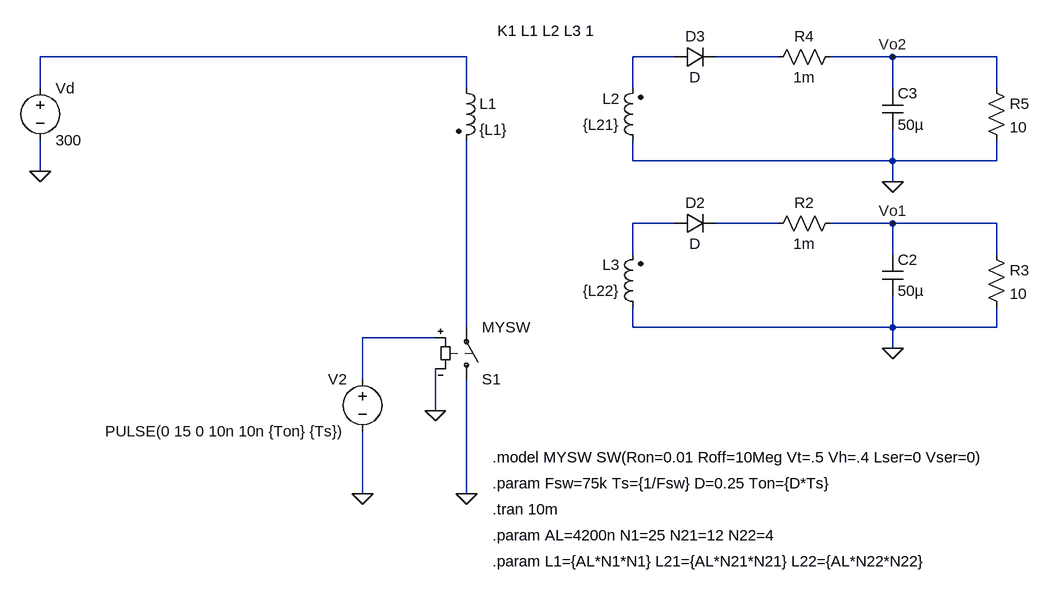
[diagram p0: schematic sch.asc]
sch.asc, the LTspice schematic file:
Version 4
SHEET 1 1032 856
WIRE -192 -336 -848 -336
WIRE 128 -336 64 -336
WIRE 288 -336 192 -336
WIRE 464 -336 368 -336
WIRE 624 -336 464 -336
WIRE -848 -288 -848 -336
WIRE -192 -288 -192 -336
WIRE 64 -288 64 -336
WIRE 464 -288 464 -336
WIRE 624 -288 624 -336
WIRE 64 -176 64 -208
WIRE 464 -176 464 -224
WIRE 464 -176 64 -176
WIRE 624 -176 624 -208
WIRE 624 -176 464 -176
WIRE -848 -160 -848 -208
WIRE 464 -144 464 -176
WIRE 128 -80 64 -80
WIRE 288 -80 192 -80
WIRE 464 -80 368 -80
WIRE 624 -80 464 -80
WIRE 64 -32 64 -80
WIRE 464 -32 464 -80
WIRE 624 -32 624 -80
WIRE -192 80 -192 -208
WIRE 64 80 64 48
WIRE 464 80 464 32
WIRE 464 80 64 80
WIRE 624 80 624 48
WIRE 624 80 464 80
WIRE -240 96 -352 96
WIRE 464 112 464 80
WIRE -352 160 -352 96
WIRE -240 208 -240 144
WIRE -352 336 -352 240
WIRE -192 336 -192 160
FLAG -192 336 0
FLAG -352 336 0
FLAG -848 -160 0
FLAG 464 -80 Vo1
FLAG -240 208 0
FLAG 464 -336 Vo2
FLAG 464 -144 0
FLAG 464 112 0
SYMBOL voltage -848 -304 R0
WINDOW 123 0 0 Left 0
WINDOW 39 0 0 Left 0
SYMATTR InstName Vd
SYMATTR Value 300
SYMBOL voltage -352 144 M0
WINDOW 123 0 0 Left 0
WINDOW 39 0 0 Left 0
SYMATTR InstName V2
SYMATTR Value PULSE(0 15 0 10n 10n {Ton} {Ts})
SYMBOL ind2 -208 -304 R0
SYMATTR InstName L1
SYMATTR Value {L1}
SYMATTR Type ind
SYMBOL ind2 80 64 R180
WINDOW 0 36 80 Left 2
WINDOW 3 36 40 Left 2
SYMATTR InstName L3
SYMATTR Value {L22}
SYMATTR Type ind
SYMBOL sw -192 176 M180
SYMATTR InstName S1
SYMATTR Value MYSW
SYMBOL diode 128 -64 R270
WINDOW 0 32 32 VTop 2
WINDOW 3 0 32 VBottom 2
SYMATTR InstName D2
SYMBOL res 384 -96 R90
WINDOW 0 0 56 VBottom 2
WINDOW 3 32 56 VTop 2
SYMATTR InstName R2
SYMATTR Value 1m
SYMBOL cap 448 -32 R0
SYMATTR InstName C2
SYMATTR Value 50µ
SYMBOL res 608 -48 R0
SYMATTR InstName R3
SYMATTR Value 10
SYMBOL ind2 80 -192 R180
WINDOW 0 36 80 Left 2
WINDOW 3 36 40 Left 2
SYMATTR InstName L2
SYMATTR Value {L21}
SYMATTR Type ind
SYMBOL diode 128 -320 R270
WINDOW 0 32 32 VTop 2
WINDOW 3 0 32 VBottom 2
SYMATTR InstName D3
SYMBOL res 384 -352 R90
WINDOW 0 0 56 VBottom 2
WINDOW 3 32 56 VTop 2
SYMATTR InstName R4
SYMATTR Value 1m
SYMBOL cap 448 -288 R0
SYMATTR InstName C3
SYMATTR Value 50µ
SYMBOL res 608 -304 R0
SYMATTR InstName R5
SYMATTR Value 10
TEXT -144 -376 Left 2 !K1 L1 L2 L3 1
TEXT -152 280 Left 2 !.model MYSW SW(Ron=0.01 Roff=10Meg Vt=.5 Vh=.4 Lser=0 Vser=0)
TEXT -152 360 Left 2 !.tran 10m
TEXT -152 320 Left 2 !.param Fsw=75k Ts={1/Fsw} D=0.25 Ton={D*Ts}
TEXT -152 400 Left 2 !.param AL=4200n N1=25 N21=12 N22=4
TEXT -152 440 Left 2 !.param L1={AL*N1*N1} L21={AL*N21*N21} L22={AL*N22*N22}

The netlist it stands for:
* sch.asc
Vd N001 0 300
V2 N007 0 PULSE(0 15 0 10n 10n {Ton} {Ts})
L1 N001 N006 {L1}
L3 0 N004 {L22}
S1 0 N006 N007 0 MYSW
D2 N004 N005 D
R2 Vo1 N005 1m
C2 Vo1 0 50µ
R3 Vo1 0 10
L2 0 N002 {L21}
D3 N002 N003 D
R4 Vo2 N003 1m
C3 Vo2 0 50µ
R5 Vo2 0 10
.model D D
.lib standard.dio
K1 L1 L2 L3 1
.model MYSW SW(Ron=0.01 Roff=10Meg Vt=.5 Vh=.4 Lser=0 Vser=0)
.tran 10m
.param Fsw=75k Ts={1/Fsw} D=0.25 Ton={D*Ts}
.param AL=4200n N1=25 N21=12 N22=4
.param L1={AL*N1*N1} L21={AL*N21*N21} L22={AL*N22*N22}
.backanno
.end